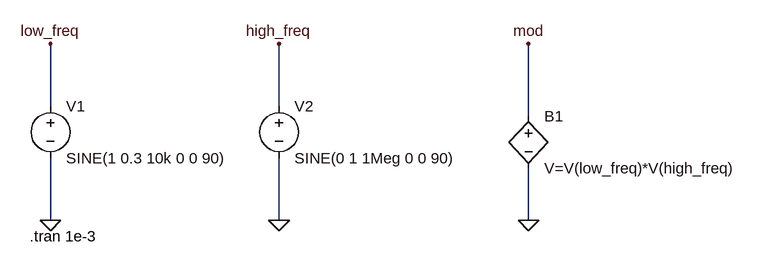
[diagram p0: schematic Mod_Generator.asc]
Mod_Generator.asc, the LTspice schematic file:
Version 4.1
SHEET 1 1172 680
WIRE -96 128 -96 32
WIRE 256 128 256 32
WIRE 640 144 640 32
WIRE -96 304 -96 208
WIRE 256 304 256 208
WIRE 640 304 640 224
FLAG -96 304 0
FLAG 256 304 0
FLAG -96 32 low_freq
FLAG 256 32 high_freq
FLAG 640 304 0
FLAG 640 32 mod
SYMBOL voltage -96 112 R0
WINDOW 123 0 0 Left 0
WINDOW 39 0 0 Left 0
SYMATTR InstName V1
SYMATTR Value SINE(1 0.3 10k 0 0 90)
SYMBOL voltage 256 112 R0
WINDOW 123 0 0 Left 0
WINDOW 39 0 0 Left 0
SYMATTR InstName V2
SYMATTR Value SINE(0 1 1Meg 0 0 90)
SYMBOL bv 640 128 R0
SYMATTR InstName B1
SYMATTR Value V=V(low_freq)*V(high_freq)
TEXT -128 328 Left 2 !.tran 1e-3

The netlist it stands for:
* Mod_Generator.asc
V1 low_freq 0 SINE(1 0.3 10k 0 0 90)
V2 high_freq 0 SINE(0 1 1Meg 0 0 90)
B1 mod 0 V=V(low_freq)*V(high_freq)
.tran 1e-3
.backanno
.end

* Results of the author's LTspice run, read from the files saved beside the schematic
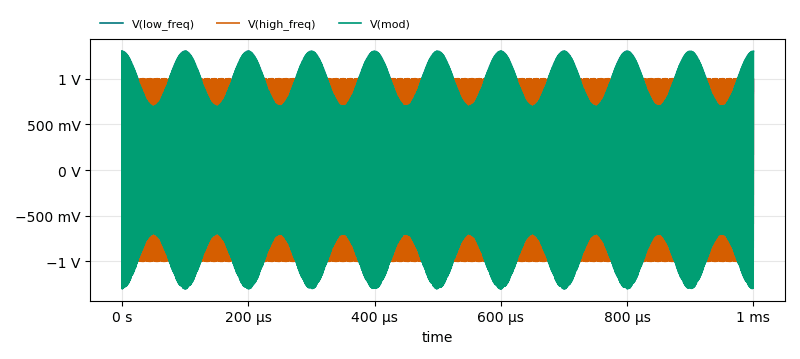
[diagram p1: Transient Analysis of Mod_Generator.asc, plotted from the saved traces]
* Transient Analysis, 1 run:
*   V(low_freq): min 700 mV, max 1.3 V, average 1 V, rms 1.022 V, last 1.3 V
*   V(high_freq): min -1 V, max 1 V, average -1.101 µV, rms 719.4 mV, last 1 V
*   V(mod): min -1.3 V, max 1.3 V, average -1.358 µV, rms 735.4 mV, last 1.3 V